# Altium schematic sheet [8] Conectors.SchDoc
size A3; DocumentNumber: 8; SheetNumber: 8; SheetTotal: 9
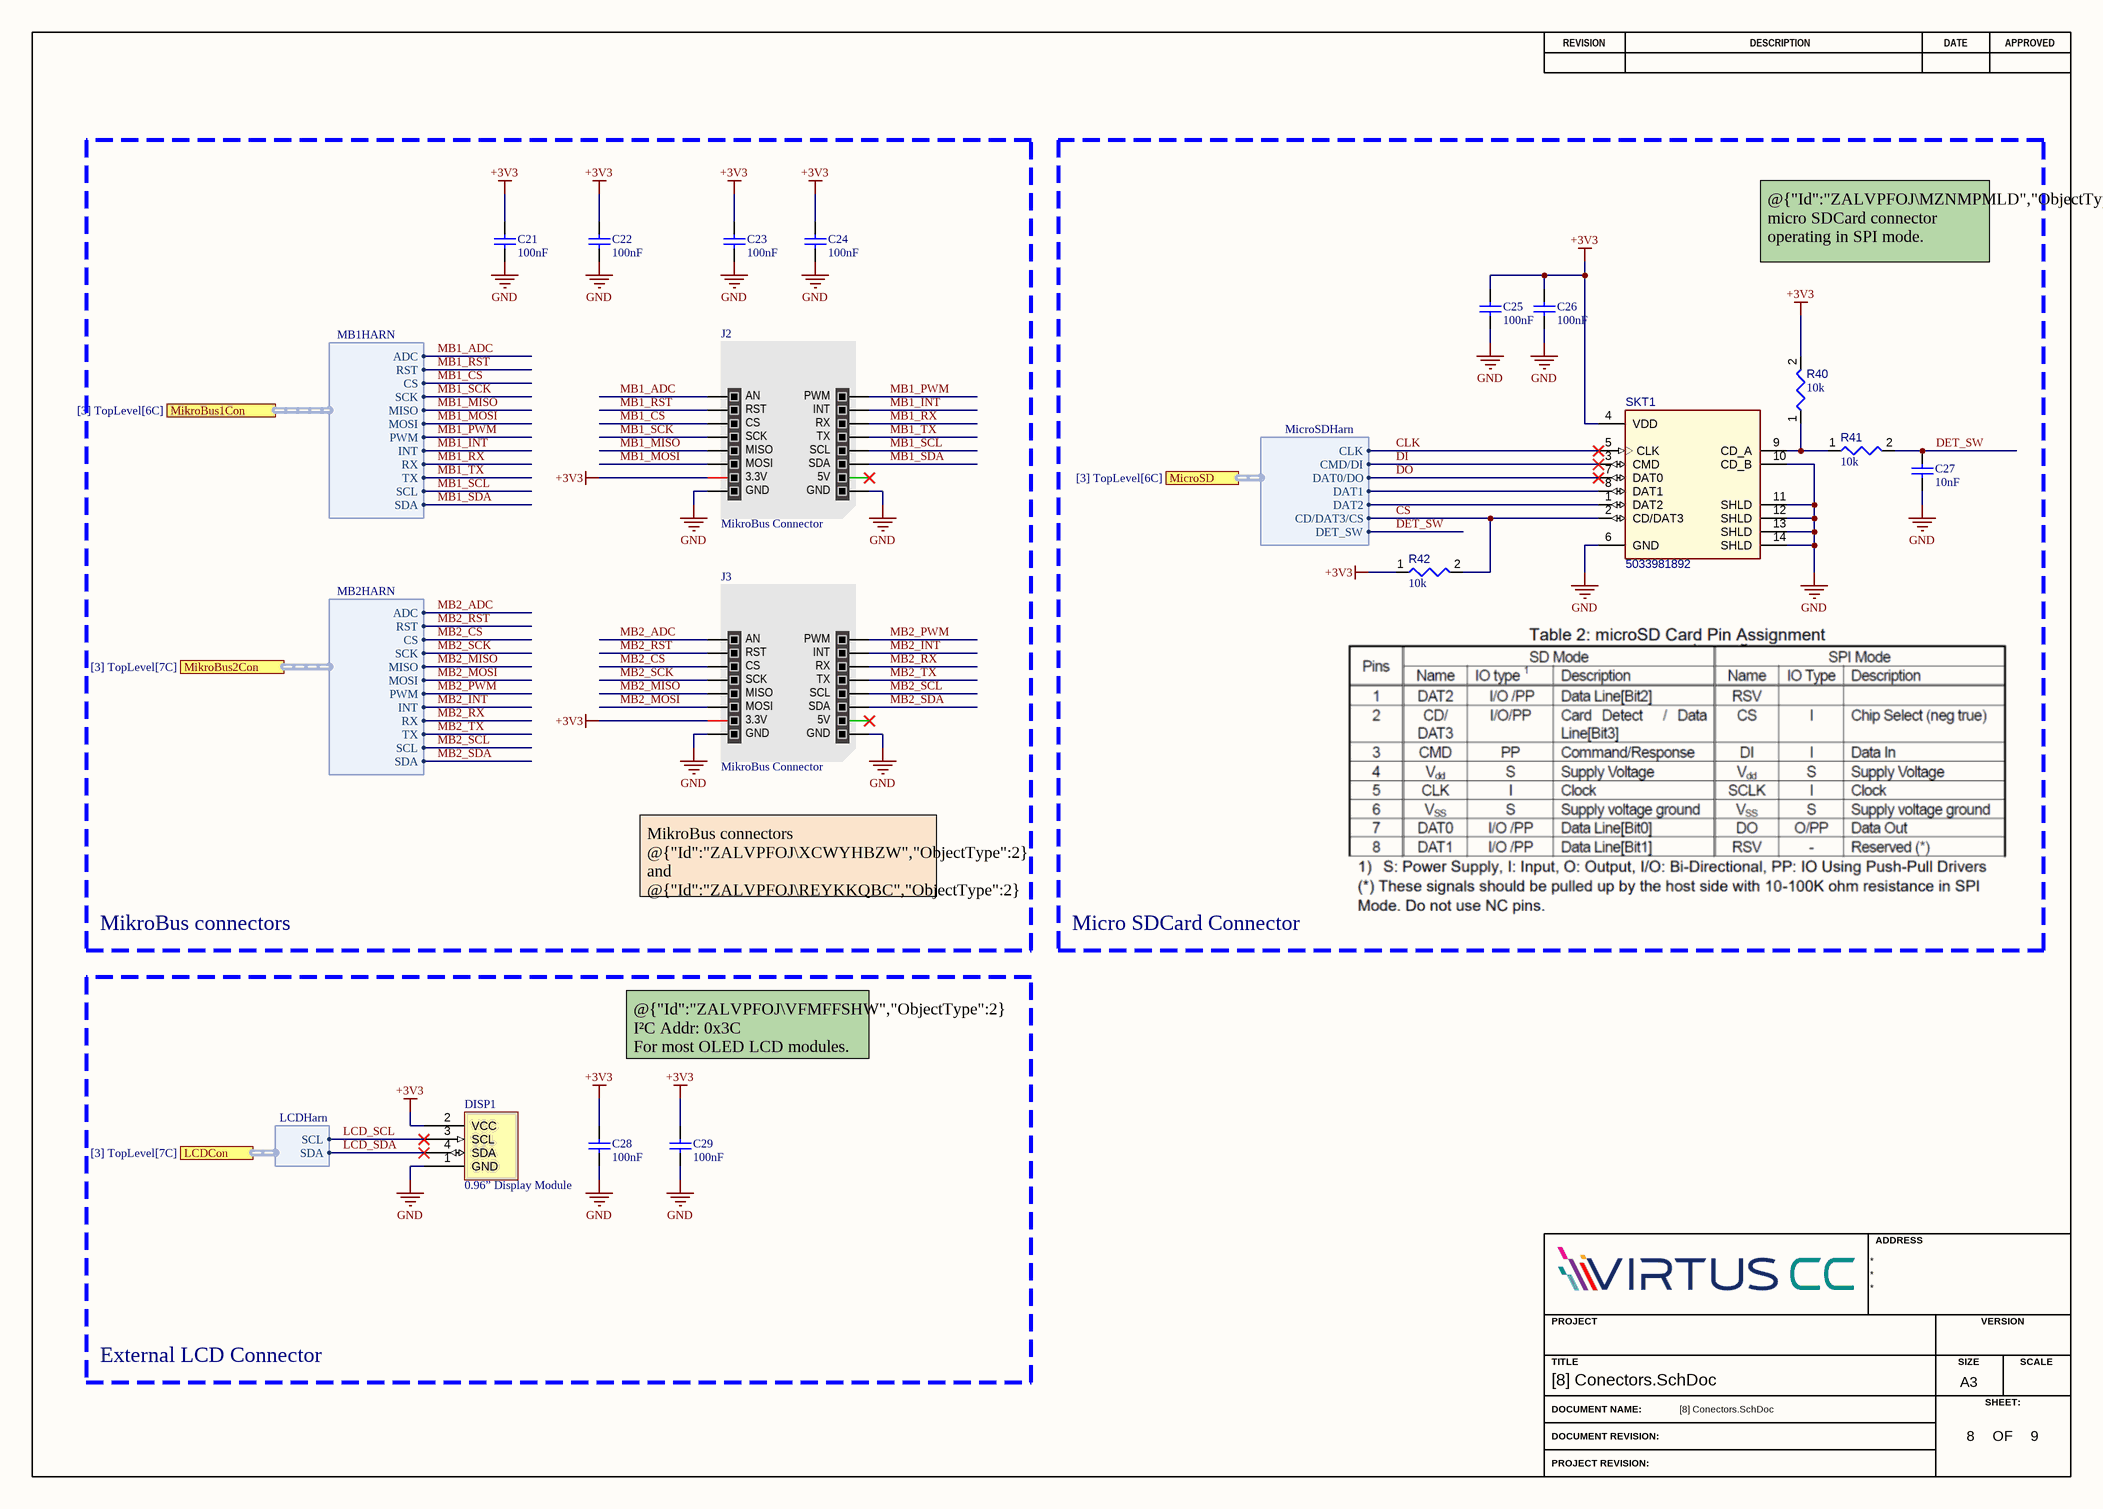
[diagram p0: [8] Conectors.SchDoc]

## Parts
C21  value 100nF  [CAPC0603(1608)100_L]  (hidden comment: VJ0603Y104MXJCW1BC)
C22  value 100nF  [CAPC0603(1608)100_L]  (hidden comment: VJ0603Y104MXJCW1BC)
C23  value 100nF  [CAPC0603(1608)100_L]  (hidden comment: VJ0603Y104MXJCW1BC)
C24  value 100nF  [CAPC0603(1608)100_L]  (hidden comment: VJ0603Y104MXJCW1BC)
C25  value 100nF  [CAPC0603(1608)100_L]  (hidden comment: VJ0603Y104MXJCW1BC)
C26  value 100nF  [CAPC0603(1608)100_L]  (hidden comment: VJ0603Y104MXJCW1BC)
C27  value 10nF  [CAPC0603(1608)100_L]  (hidden comment: VJ0603Y103KXAAC)
C28  value 100nF  [CAPC0603(1608)100_L]  (hidden comment: VJ0603Y104MXJCW1BC)
C29  value 100nF  [CAPC0603(1608)100_L]  (hidden comment: VJ0603Y104MXJCW1BC)
DISP1  0.96” Display Module  [New footprint 1]
J2  MikroBus Connector  [New footprint 1]
J3  MikroBus Connector  [New footprint 1]
R40  value 10k  [RESC0603(1608)_L]  (hidden comment: Resistor 10k +/-1% 0603 100 mW)
R41  value 10k  [RESC0603(1608)_L]  (hidden comment: Resistor 10k +/-1% 0603 100 mW)
R42  value 10k  [RESC0603(1608)_L]  (hidden comment: Resistor 10k +/-1% 0603 100 mW)
SKT1  5033981892  [MOLX-5033981892_V]

## Blocks framed on the sheet
MikroBus connectors: C21-C24 J2 J3
Micro SDCard Connector: C25-C27 R40-R42 SKT1
External LCD Connector: C28 C29 DISP1

## Ports
LCDCon (harness LCDHarn, see [3] TopLevel[7C]), MicroSD (harness MicroSDHarn, see [3] TopLevel[6C]), MikroBus1Con (harness MB1HARN, see [3] TopLevel[6C]), MikroBus2Con (harness MB2HARN, see [3] TopLevel[7C])

## Harnesses
MB2HARN: ADC, RST, CS, SCK, MISO, MOSI, PWM, INT, RX, TX, SCL, SDA
MB1HARN: ADC, RST, CS, SCK, MISO, MOSI, PWM, INT, RX, TX, SCL, SDA
MicroSDHarn: CLK, CMD/DI, DAT0/DO, DAT1, DAT2, CD/DAT3/CS, DET_SW
LCDHarn: SCL, SDA

## Nets
+3V3: C21.2 C22.2 C23.2 C24.2 C25.2 C26.2 C28.2 C29.2 DISP1.2(VCC) J2.7(3.3V) J3.7(3.3V) R40.2 R42.1 SKT1.4(VDD)
GND: C21.1 C22.1 C23.1 C24.1 C25.1 C26.1 C27.1 C28.1 C29.1 DISP1.1(GND) J2.8(GND) J2.9(GND) J3.8(GND) J3.9(GND) SKT1.6(GND) SKT1.10(CD_B) SKT1.11(SHLD) SKT1.12(SHLD) SKT1.13(SHLD) SKT1.14(SHLD)
CLK: SKT1.5(CLK) ; port MicroSD.CLK
CS: R42.2 SKT1.2(CD/DAT3) ; port MicroSD.CD/DAT3/CS
DET_SW: C27.2 R41.2 ; port MicroSD.DET_SW
DI: SKT1.3(CMD) ; port MicroSD.CMD/DI
DO: SKT1.7(DAT0) ; port MicroSD.DAT0/DO
LCD_SCL: DISP1.3(SCL) ; port LCDCon.SCL
LCD_SDA: DISP1.4(SDA) ; port LCDCon.SDA
MB1_ADC: J2.1(AN) ; port MikroBus1Con.ADC
MB1_CS: J2.3(CS) ; port MikroBus1Con.CS
MB1_INT: J2.15(INT) ; port MikroBus1Con.INT
MB1_MISO: J2.5(MISO) ; port MikroBus1Con.MISO
MB1_MOSI: J2.6(MOSI) ; port MikroBus1Con.MOSI
MB1_PWM: J2.16(PWM) ; port MikroBus1Con.PWM
MB1_RST: J2.2(RST) ; port MikroBus1Con.RST
MB1_RX: J2.14(RX) ; port MikroBus1Con.RX
MB1_SCK: J2.4(SCK) ; port MikroBus1Con.SCK
MB1_SCL: J2.12(SCL) ; port MikroBus1Con.SCL
MB1_SDA: J2.11(SDA) ; port MikroBus1Con.SDA
MB1_TX: J2.13(TX) ; port MikroBus1Con.TX
MB2_ADC: J3.1(AN) ; port MikroBus2Con.ADC
MB2_CS: J3.3(CS) ; port MikroBus2Con.CS
MB2_INT: J3.15(INT) ; port MikroBus2Con.INT
MB2_MISO: J3.5(MISO) ; port MikroBus2Con.MISO
MB2_MOSI: J3.6(MOSI) ; port MikroBus2Con.MOSI
MB2_PWM: J3.16(PWM) ; port MikroBus2Con.PWM
MB2_RST: J3.2(RST) ; port MikroBus2Con.RST
MB2_RX: J3.14(RX) ; port MikroBus2Con.RX
MB2_SCK: J3.4(SCK) ; port MikroBus2Con.SCK
MB2_SCL: J3.12(SCL) ; port MikroBus2Con.SCL
MB2_SDA: J3.11(SDA) ; port MikroBus2Con.SDA
MB2_TX: J3.13(TX) ; port MikroBus2Con.TX
NetR40_1: R40.1 R41.1 SKT1.9(CD_A)
NetSKT1_1: SKT1.1(DAT2) ; port MicroSD.DAT2
NetSKT1_8: SKT1.8(DAT1) ; port MicroSD.DAT1

Not connected (* = marked no-connect by the designer): J2 10(5V)*; J3 10(5V)*

## Notes on the sheet
- @{"Id":"ZALVPFOJ\MZNMPMLD","ObjectType":2} micro SDCard connector operating in SPI mode.
- MikroBus connectors @{"Id":"ZALVPFOJ\XCWYHBZW","ObjectType":2} and @{"Id":"ZALVPFOJ\REYKKQBC","ObjectType":2} only
  compatible with modules operating in 3.3V. 5V power supply pin is floating
- @{"Id":"ZALVPFOJ\VFMFFSHW","ObjectType":2} I²C Addr: 0x3C
  For most OLED LCD modules.
- REVISION
- DESCRIPTION
- DATE
- APPROVED
- ADDRESS
- PROJECT
- VERSION
- TITLE
- A3
- SIZE
- SCALE
- DOCUMENT NAME:
- DOCUMENT REVISION:
- OF
- SHEET:
- PROJECT REVISION:

## Library data of the parts
C21-C26 C28 C29 = CMP-001-00085-1: Multilayer Ceramic Capacitor, 0.1 uF, 16 V, ± 20%, X7R, 0603 [1608 Metric]; Dielectric Material: Tantalum; Voltage Rating: 16V; Packaging: Tape and Reel; Min Operating Temperature: -55°C; Case/Package: 0603; Length: 1.6mm; Termination: SMD/SMT; Height: 0.95mm; Mounting Technology: Surface Mount; Width: 0.8mm; Case Code (Imperial): 0603; Construction: Flat; Lead Free: Lead Free; Package Quantity: 4000; Max Operating Temperature: 125°C; Dielectric: X7R; RoHS Compliant: Yes; Depth: 0.8mm; Tolerance: 20%; Series: VJ; Case Code (Metric): 1608; Voltage Rating (DC): 16V
C27 = CMP-001-00084-1: Multilayer Ceramic Capacitor, 0.01 uF, 50 V, ± 10%, X7R, 0603 [1608 Metric]; Voltage Rating: 50V; Height: 0.92mm; Voltage Rating (DC): 50V; Depth: 0.8mm; Case Code (Imperial): 0603; Packaging: Tape and Reel; Length: 1.6mm; Max Operating Temperature: 125°C; Min Operating Temperature: -55°C; Case/Package: 0603; Pins: 2; Series: VJ; Thickness: 0.036inch; Weight: 7.1E-05oz; Reach SVHC Compliant: Unknown; Termination: SMD/SMT; Package Quantity: 1; RoHS Compliant: Yes; Mounting Technology: Surface Mount; Construction: Flat; Voltage: 50V; Lead Free: Lead Free; Width: 0.031inch; Case Code (Metric): 1608; Tolerance: 10%; Dielectric: X7R
DISP1 = CMP-003-00030-5: 0.96 Inch I2C OLED Display Module
J2 J3 = CMP-002-00071-3: MikroBus shield pico
R40-R42 = CMP-009-00017-7: Chip Resistor, 10 KOhm, +/- 1%, 01 W, -55 to 155 degC, 0603 (1608 Metric); Power: 100mW; Voltage Rating: 50V; Mounting Technology: SM; Max Operating Temperature: 155°C; Case/Package: 0603; Tolerance: 1%; RoHS Compliant: True; Pins: 2; Min Operating Temperature: -55°C
SKT1 = CMP-002-00049-5: Micro SD Card Connector, Pitch 1.1 mm, 8 Position, Height 1.4 mm, -25 to 85 degC, RoHS, Tape and Reel; Pins: 14